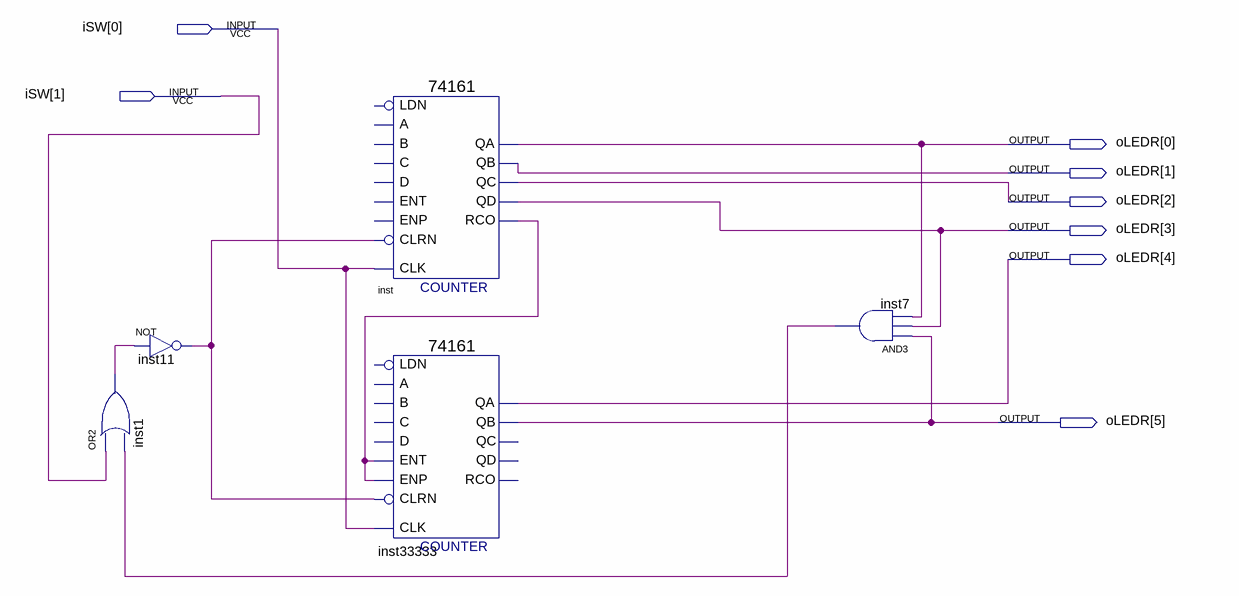
[diagram p0: schematic sheet]
// Quartus schematic L74161.bdf as structural Verilog: 5 symbols, 8 pins
module L74161 (
  input  [1:0] iSW,
  output [5:0] oLEDR
);

  wire inst1_out, inst7_out, inst11_out, inst_rco;

  or inst1 (inst1_out, iSW[1], inst7_out);
  not inst11 (inst11_out, inst1_out);
  \74161  inst (
    .CLRN(inst11_out), .CLK(iSW[0]), .QD(oLEDR[3]), .QC(oLEDR[2]), .QB(oLEDR[1]), .QA(oLEDR[0]),
    .RCO(inst_rco));  // open: ENP, LDN, A, D, ENT, B, C
  \74161  inst33333 (
    .CLRN(inst11_out), .CLK(iSW[0]), .ENP(inst_rco), .ENT(inst_rco), .QB(oLEDR[5]), .QA(oLEDR[4]));  // open: LDN, A, D, B, C, QD, QC, RCO
  and inst7 (inst7_out, oLEDR[5], oLEDR[3], oLEDR[0]);
endmodule
